# Altium schematic sheet Transistor.SchDoc: Transistor
size A4; DrawnBy: Mauro De Bruyn; Revision: 1; SheetNumber: 2; SheetTotal: 5; Number: PXL EAI1_2
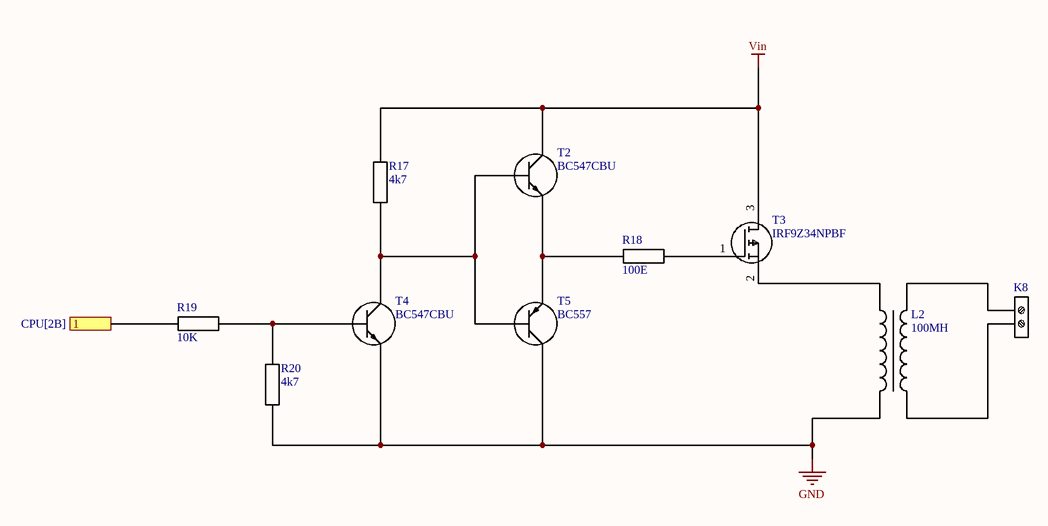
[diagram p0: Transistor.SchDoc]

## Parts
K8  2 Pin Connector 1716020000  [1716020000]  (value not drawn)
L2  100MH  [CM2545X171B10]
R17  4k7  [0805]
R18  100E  [0805]
R19  10K  [0805]
R20  4k7  [0805]
T2  BC547CBU  [BC547CBU]
T3  IRF9Z34NPBF  [TO254P469X1042X1967-3P]
T4  BC547CBU  [BC547CBU]
T5  BC557  [BC547CBU]

## Ports
1 (see CPU[2B])

## Nets
GND: L2.1(PRI+) R20.1 T4.3(E) T5.3(E)
Vin: R17.2 T2.1(C) T3.3(D)
1: R19.1 ; port 1
NetK8_1: K8.1 L2.3(SEC-)
NetK8_2: K8.2 L2.4(PRI-)
NetL2_2: L2.2(SEC+) T3.2(S)
NetR17_1: R17.1 T2.2(B) T4.1(C) T5.2(B)
NetR18_1: R18.1 T3.1(G)
NetR18_2: R18.2 T2.3(E) T5.1(C)
NetR19_2: R19.2 R20.2 T4.2(B)

## Library data of the parts
K8 = 2 Pin Connector 1716020000: Connector; Manufacturer_Name: Weidmuller; Datasheet Link: https://catalog.weidmueller.com/catalog/Start.do?ObjectID=1716020000&_ga=2.21797499.1716783809.1613378202-511725545.1613378202; Manufacturer_Part_Number: 1716020000
L2 = CM2545X171B-10: Transformer; Manufacturer_Name: Laird Technologies; Datasheet Link: https://datasheet.datasheetarchive.com/originals/dk/DKDS-7/122753.pdf; Height: 9.5mm; Manufacturer_Part_Number: CM2545X171B-10
R17-R20 = 0805 (Resistor): Resistor; Manufacturer_Name: Kemet; Manufacturer_Part_Number: C0805C391G3GACTU; Datasheet Link: https://content.kemet.com/datasheets/KEM_C1003_C0G_SMD.pdf; Height: 1.1mm
T2 T4 = BC547CBU: Transistor BJT NPN; Manufacturer_Name: ON Semiconductor; Datasheet Link: https://www.onsemi.com/pdf/datasheet/bc550-d.pdf; Height: 5.33mm; Manufacturer_Part_Number: BC547CBU
T3 = IRF9Z34NPBF: MOSFET (P-Channel); Manufacturer_Name: Infineon; Datasheet Link: https://componentsearchengine.com//IRF9Z34NPBF.pdf; Height: 4.69mm; Mouser2 Part Number: 942-IRF9Z34NPBF; Mouser2 Price/Stock: https://www.mouser.com/Search/Refine.aspx?Keyword=942-IRF9Z34NPBF; Manufacturer_Part_Number: IRF9Z34NPBF
T5 = BC557: Transistor BJT NPN; Manufacturer_Name: ON Semiconductor; Datasheet Link: https://www.onsemi.com/pdf/datasheet/bc550-d.pdf; Height: 5.33mm; Manufacturer_Part_Number: BC547CBU